# Altium schematic sheet 1 040 1573.rev01_driver.SchDoc
size A4; SheetNumber: 5; SheetTotal: 5
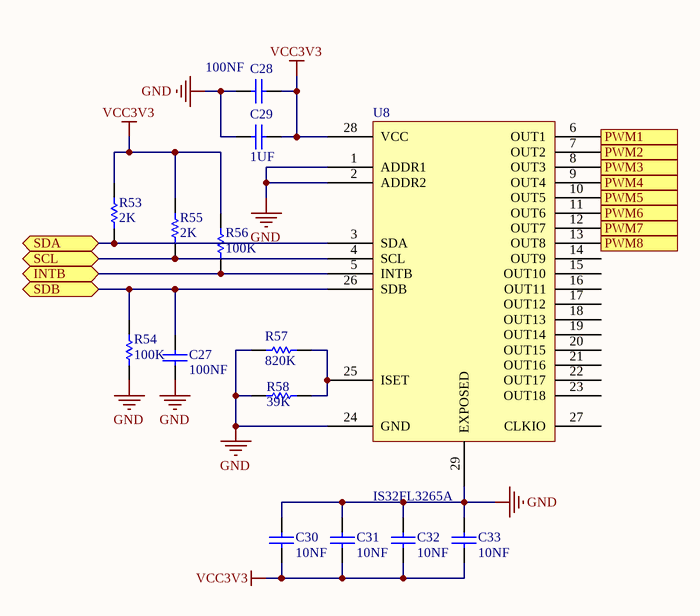
[diagram p0: 1 040 1573.rev01_driver.SchDoc]

## Parts
C27  100NF  [Capacitor(0603)-1]
C28  100NF  [Capacitor(0603)-1]
C29  1UF  [Capacitor(0603)-1]
C30  10NF  [Capacitor(0603)-1]
C31  10NF  [Capacitor(0603)-1]
C32  10NF  [Capacitor(0603)-1]
C33  10NF  [Capacitor(0603)-1]
R53  2K  [Resistor(0603) -1]
R54  100K  [Resistor(0603) -1]
R55  2K  [Resistor(0603) -1]
R56  100K  [Resistor(0603) -1]
R57  820K  [Resistor(0603) -1]
R58  39K  [Resistor(0603) -1]
U8  IS32FL3265A  [SOP65P640X120-29N]

## Ports
INTB (bidir, see Sanel_Can_Lin_Pwm_Schem[4B]), PWM1 (out, see High_side_pwm[1D]), PWM2 (out, see High_side_pwm[1D]), PWM3 (out, see High_side_pwm[2D]), PWM4 (out, see High_side_pwm[3D]), PWM5 (out, see High_side_pwm[1B]), PWM6 (out, see High_side_pwm[1B]), PWM7 (out, see High_side_pwm[2B]), PWM8 (out, see High_side_pwm[3B]), SCL (bidir, see Sanel_Can_Lin_Pwm_Schem[3C]), SDA (bidir, see Sanel_Can_Lin_Pwm_Schem[3C]), SDB (bidir, see Sanel_Can_Lin_Pwm_Schem[4B])

## Nets
GND: C27.1 C28.1 C29.2 C30.1 C31.1 C32.1 C33.1 R54.1 R57.1 R58.1 U8.1(ADDR1) U8.2(ADDR2) U8.24(GND) U8.29(EXPOSED)
VCC3V3: C28.2 C29.1 C30.2 C31.2 C32.2 C33.2 R53.2 R55.2 R56.2 U8.28(VCC)
INTB: R56.1 U8.5(INTB) ; port INTB
PWM1: U8.6(OUT1) ; port PWM1
PWM2: U8.7(OUT2) ; port PWM2
PWM3: U8.8(OUT3) ; port PWM3
PWM4: U8.9(OUT4) ; port PWM4
PWM5: U8.10(OUT5) ; port PWM5
PWM6: U8.11(OUT6) ; port PWM6
PWM7: U8.12(OUT7) ; port PWM7
PWM8: U8.13(OUT8) ; port PWM8
SCL: R55.1 U8.4(SCL) ; port SCL
SDA: R53.1 U8.3(SDA) ; port SDA
SDB: C27.2 R54.2 U8.26(SDB) ; port SDB
NetR57_2: R57.2 R58.2 U8.25(ISET)

Not connected (* = marked no-connect by the designer): U8 14(OUT9) 15(OUT10) 16(OUT11) 17(OUT12) 18(OUT13) 19(OUT14) 20(OUT15) 21(OUT16) 22(OUT17) 23(OUT18) 27(CLKIO)

## Library data of the parts
C27 C28 = CAP_CER_SMD_100NF_50V_0603_AEC: 1 043 0098; Published: 8-Jun-2000; LatestRevisionDate: 17-Jul-2002; LatestRevisionNote: Re-released for DXP Platform.; PackageReference: RAD-0.3; Publisher: Altium Limited; Stok Kodu: 1 043 0098
C29 = CAP_CER_SMD_1UF_50V_0603_AEC: 1 043 0030; Published: 8-Jun-2000; LatestRevisionDate: 17-Jul-2002; LatestRevisionNote: Re-released for DXP Platform.; PackageReference: RAD-0.3; Publisher: Altium Limited; Stok Kodu: 1 043 0030
C30-C33 = CAP_CER_SMD_10NF_50V_0603_AEC: 1 043 0103; Published: 8-Jun-2000; LatestRevisionDate: 17-Jul-2002; LatestRevisionNote: Re-released for DXP Platform.; PackageReference: RAD-0.3; Publisher: Altium Limited; Stok Kodu: 1 043 0103
R53 R55 = RES_SMD_2K_%5_0603: 1 042 0399; Published: 8-Jun-2000; LatestRevisionDate: 17-Jul-2002; LatestRevisionNote: Re-released for DXP Platform.; PackageReference: AXIAL-0.3; Publisher: Altium Limited; Stok Kodu: 1 042 0399
R54 R56 = RES_SMD_100K_%1_0603_AEC: 1 042 0261; Published: 8-Jun-2000; LatestRevisionDate: 17-Jul-2002; LatestRevisionNote: Re-released for DXP Platform.; PackageReference: AXIAL-0.3; Publisher: Altium Limited; Stok Kodu: 1 042 0261
R57 = RES_SMD_820K_%5_0603: 1 042 0543; Published: 8-Jun-2000; LatestRevisionDate: 17-Jul-2002; LatestRevisionNote: Re-released for DXP Platform.; PackageReference: AXIAL-0.3; Publisher: Altium Limited; Stok Kodu: 1 042 0543
R58 = RES_SMD_39K_%5_0603: 1 042 0446; Published: 8-Jun-2000; LatestRevisionDate: 17-Jul-2002; LatestRevisionNote: Re-released for DXP Platform.; PackageReference: AXIAL-0.3; Publisher: Altium Limited; Stok Kodu: 1 042 0446